# Altium schematic sheet Top_Level.SchDoc
size 381 x 381 mm
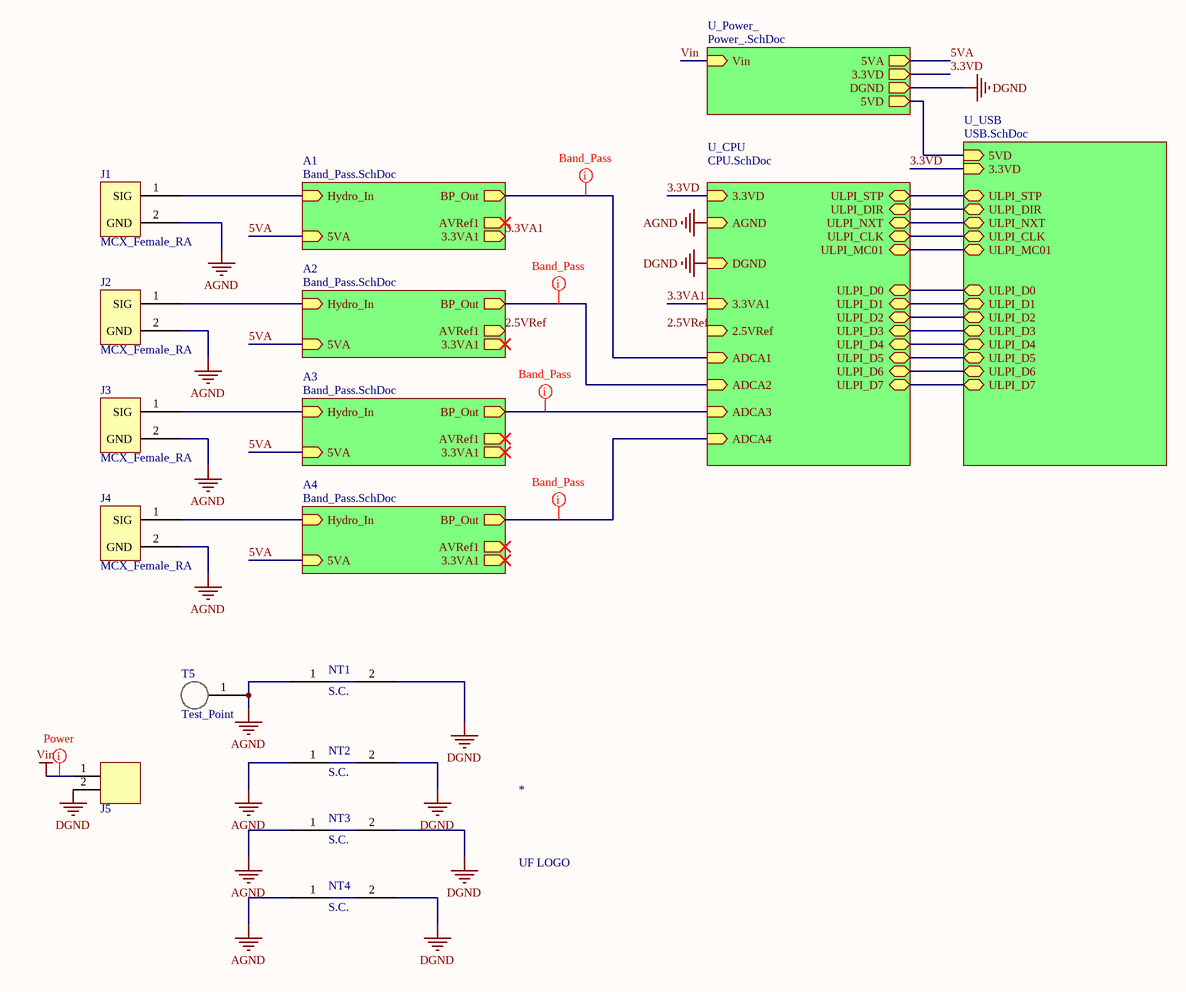
[diagram p0: Top_Level.SchDoc]

## Parts
*  UF LOGO  [UF LOGO-1000]
J1  MCX_Female_RA  [MCX_Female]
J2  MCX_Female_RA  [MCX_Female]
J3  MCX_Female_RA  [MCX_Female]
J4  MCX_Female_RA  [MCX_Female]
J5  2-pin Horz Sherlock  [MOLEX-HDR-1X2-SHERLOCK-HORZ]  (value not drawn)
MIL  MIL LOGO  [MIL LOGO - 500]  (value not drawn)
NT1  S.C.  [Net_Tie]
NT2  S.C.  [Net_Tie]
NT3  S.C.  [Net_Tie]
NT4  S.C.  [Net_Tie]
T5  Test_Point  [TP]

## Sub-sheets
A1 = Band_Pass.SchDoc: Hydro_In (in), BP_Out (out), 5VA (in), 3.3VA1 (out), AVRef1 (out)
A2 = Band_Pass.SchDoc: Hydro_In (in), BP_Out (out), 5VA (in), AVRef1 (out), 3.3VA1 (out)
A3 = Band_Pass.SchDoc: Hydro_In (in), BP_Out (out), 5VA (in), AVRef1 (out), 3.3VA1 (out)
A4 = Band_Pass.SchDoc: Hydro_In (in), BP_Out (out), 5VA (in), AVRef1 (out), 3.3VA1 (out)
U_CPU = CPU.SchDoc: 3.3VD (in), AGND (in), DGND (in), 3.3VA1 (in), 2.5VRef (in), ADCA1 (in), ADCA2 (in), ADCA3 (in), ADCA4 (in), ULPI_STP (bidir), ULPI_DIR (bidir), ULPI_NXT (bidir), ULPI_D0 (bidir), ULPI_D1 (bidir), ULPI_CLK (bidir), ULPI_D2 (bidir), ULPI_D3 (bidir), ULPI_D4 (bidir), ULPI_D5 (bidir), ULPI_D6 (bidir), ULPI_D7 (bidir), ULPI_MC01 (bidir)
U_Power_ = Power_.SchDoc: 5VA (out), Vin (in), 3.3VD (out), DGND (out), 5VD (out)
U_USB = USB.SchDoc: 5VD (in), 3.3VD (in), ULPI_STP (bidir), ULPI_DIR (bidir), ULPI_NXT (bidir), ULPI_D0 (bidir), ULPI_D1 (bidir), ULPI_CLK (bidir), ULPI_D2 (bidir), ULPI_D3 (bidir), ULPI_D4 (bidir), ULPI_D5 (bidir), ULPI_D6 (bidir), ULPI_MC01 (bidir), ULPI_D7 (bidir)

## Nets
AGND: J1.2(GND) J2.2(GND) J3.2(GND) J4.2(GND) NT1.1 NT2.1 NT3.1 NT4.1 T5.1 ; sheet U_CPU/AGND
DGND: J5.2 NT1.2 NT2.2 NT3.2 NT4.2 ; sheet U_Power_/DGND, sheet U_CPU/DGND
Vin: J5.1 ; sheet U_Power_/Vin
2.5VRef: sheet A2/AVRef1
3.3VA1: sheet A1/3.3VA1, sheet U_CPU/3.3VA1
3.3VD: sheet U_Power_/3.3VD, sheet U_CPU/3.3VD, sheet U_USB/3.3VD
5VA: sheet A1/5VA, sheet A2/5VA, sheet A3/5VA, sheet A4/5VA, sheet U_Power_/5VA
NetJ1_1: J1.1(SIG) ; sheet A1/Hydro_In
NetJ2_1: J2.1(SIG) ; sheet A2/Hydro_In
NetJ3_1: J3.1(SIG) ; sheet A3/Hydro_In
NetJ4_1: J4.1(SIG) ; sheet A4/Hydro_In
(unnamed): sheet A1/BP_Out, sheet U_CPU/ADCA1
(unnamed): sheet A2/BP_Out, sheet U_CPU/ADCA2
(unnamed): sheet A3/BP_Out, sheet U_CPU/ADCA3
(unnamed): sheet A4/BP_Out, sheet U_CPU/ADCA4
(unnamed): sheet U_Power_/5VD, sheet U_USB/5VD
(unnamed): sheet U_CPU/ULPI_STP, sheet U_USB/ULPI_STP
(unnamed): sheet U_CPU/ULPI_DIR, sheet U_USB/ULPI_DIR
(unnamed): sheet U_CPU/ULPI_NXT, sheet U_USB/ULPI_NXT
(unnamed): sheet U_CPU/ULPI_D0, sheet U_USB/ULPI_D0
(unnamed): sheet U_CPU/ULPI_D1, sheet U_USB/ULPI_D1
(unnamed): sheet U_CPU/ULPI_CLK, sheet U_USB/ULPI_CLK
(unnamed): sheet U_CPU/ULPI_D2, sheet U_USB/ULPI_D2
(unnamed): sheet U_CPU/ULPI_D3, sheet U_USB/ULPI_D3
(unnamed): sheet U_CPU/ULPI_D4, sheet U_USB/ULPI_D4
(unnamed): sheet U_CPU/ULPI_D5, sheet U_USB/ULPI_D5
(unnamed): sheet U_CPU/ULPI_D6, sheet U_USB/ULPI_D6
(unnamed): sheet U_CPU/ULPI_D7, sheet U_USB/ULPI_D7
(unnamed): sheet U_CPU/ULPI_MC01, sheet U_USB/ULPI_MC01

## Layout directives
net class Power: Vin
net class Band_Pass: (no net found under the mark)

## Notes on the sheet
- Labels drawn without touching a wire or pin: 2.5VRef

## Library data of the parts
J1-J4 = MCX_Female_RA: CONN MCX JACK R/A 50 OHM PCB; Supplier 1: Digi-Key; Supplier Part Number 1: A98546-ND
J5 = MOLEX-HDR-1x2-SHERLOCK_RA: Header, Molex, 2mm Pitch Sherlock Header, Single Row, Horizontal, 2 Circuits, Length 3.3mm,  0353630260; Manufacturer: Molex Inc; Manufacturer Part Number: 0353630260; Supplier Part Number 1: WM18931-ND; Supplier 1: Digi-Key
NT1-NT4 = Net_Tie
T5 = Test_Point: TEST POINT PC COMPACT .063"D; Supplier 1: Digi-Key; Supplier Part Number 1: 5006K-ND